# Altium schematic sheet controller_task.SchDoc
size A
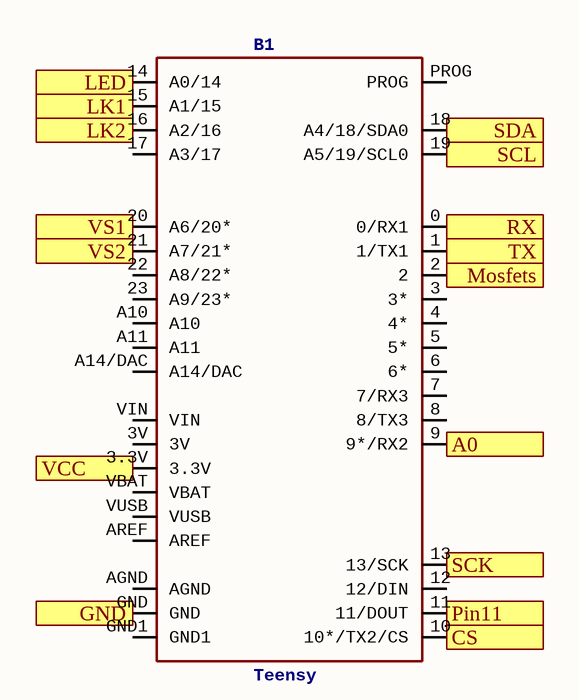
[diagram p0: controller_task.SchDoc]

## Parts
B1  Teensy  [TEENSY-3.1]

## Ports
A0 (out), CS (out), GND (out), LED (out), LK1 (in), LK2 (in), Mosfets (out), Pin11 (out), RX (in), SCK (in), SCL (out), SDA (out), TX (out), VCC (out), VS1 (out), VS2 (out)

## Nets
A0: B1.9(9*/RX2) ; port A0
CS: B1.10(10*/TX2/CS) ; port CS
GND: B1.GND ; port GND
LED: B1.14(A0/14) ; port LED
LK1: B1.15(A1/15) ; port LK1
LK2: B1.16(A2/16) ; port LK2
Mosfets: B1.2 ; port Mosfets
Pin11: B1.11(11/DOUT) ; port Pin11
RX: B1.0(0/RX1) ; port RX
SCK: B1.13(13/SCK) ; port SCK
SCL: B1.19(A5/19/SCL0) ; port SCL
SDA: B1.18(A4/18/SDA0) ; port SDA
TX: B1.1(1/TX1) ; port TX
VCC: B1.3.3V ; port VCC
VS1: B1.20(A6/20*) ; port VS1
VS2: B1.21(A7/21*) ; port VS2

Not connected (* = marked no-connect by the designer): B1 3(3*) 3V 4(4*) 5(5*) 6(6*) 7(7/RX3) 8(8/TX3) 12(12/DIN) 17(A3/17) 22(A8/22*) 23(A9/23*) A10 A11 A14/DAC AGND AREF GND1 PROG VBAT VIN VUSB

## Library data of the parts
B1 = TEENSY-3.1SILK: GateName_1: G$1; SymbolName_1: TEENSY-31; DeviceName: SILK; SF_ID: DEV-12646; LibraryName: SparkFun-Boards; DeviceSetName: TEENSY-3.1; Package: TEENSY-3.1